# EasyEDA Pro project ProPrj_alba_2026-09-08.epro

# Schematic Schematic1
Board Name: Board1; Create Date: 2026-08-04; Page Name: P1; Project Name: alba; Schematic Name: Schematic1; Update Date: 2026-08-06; Company: 嘉立创EDA; Page Size: A4; Version: V1.0
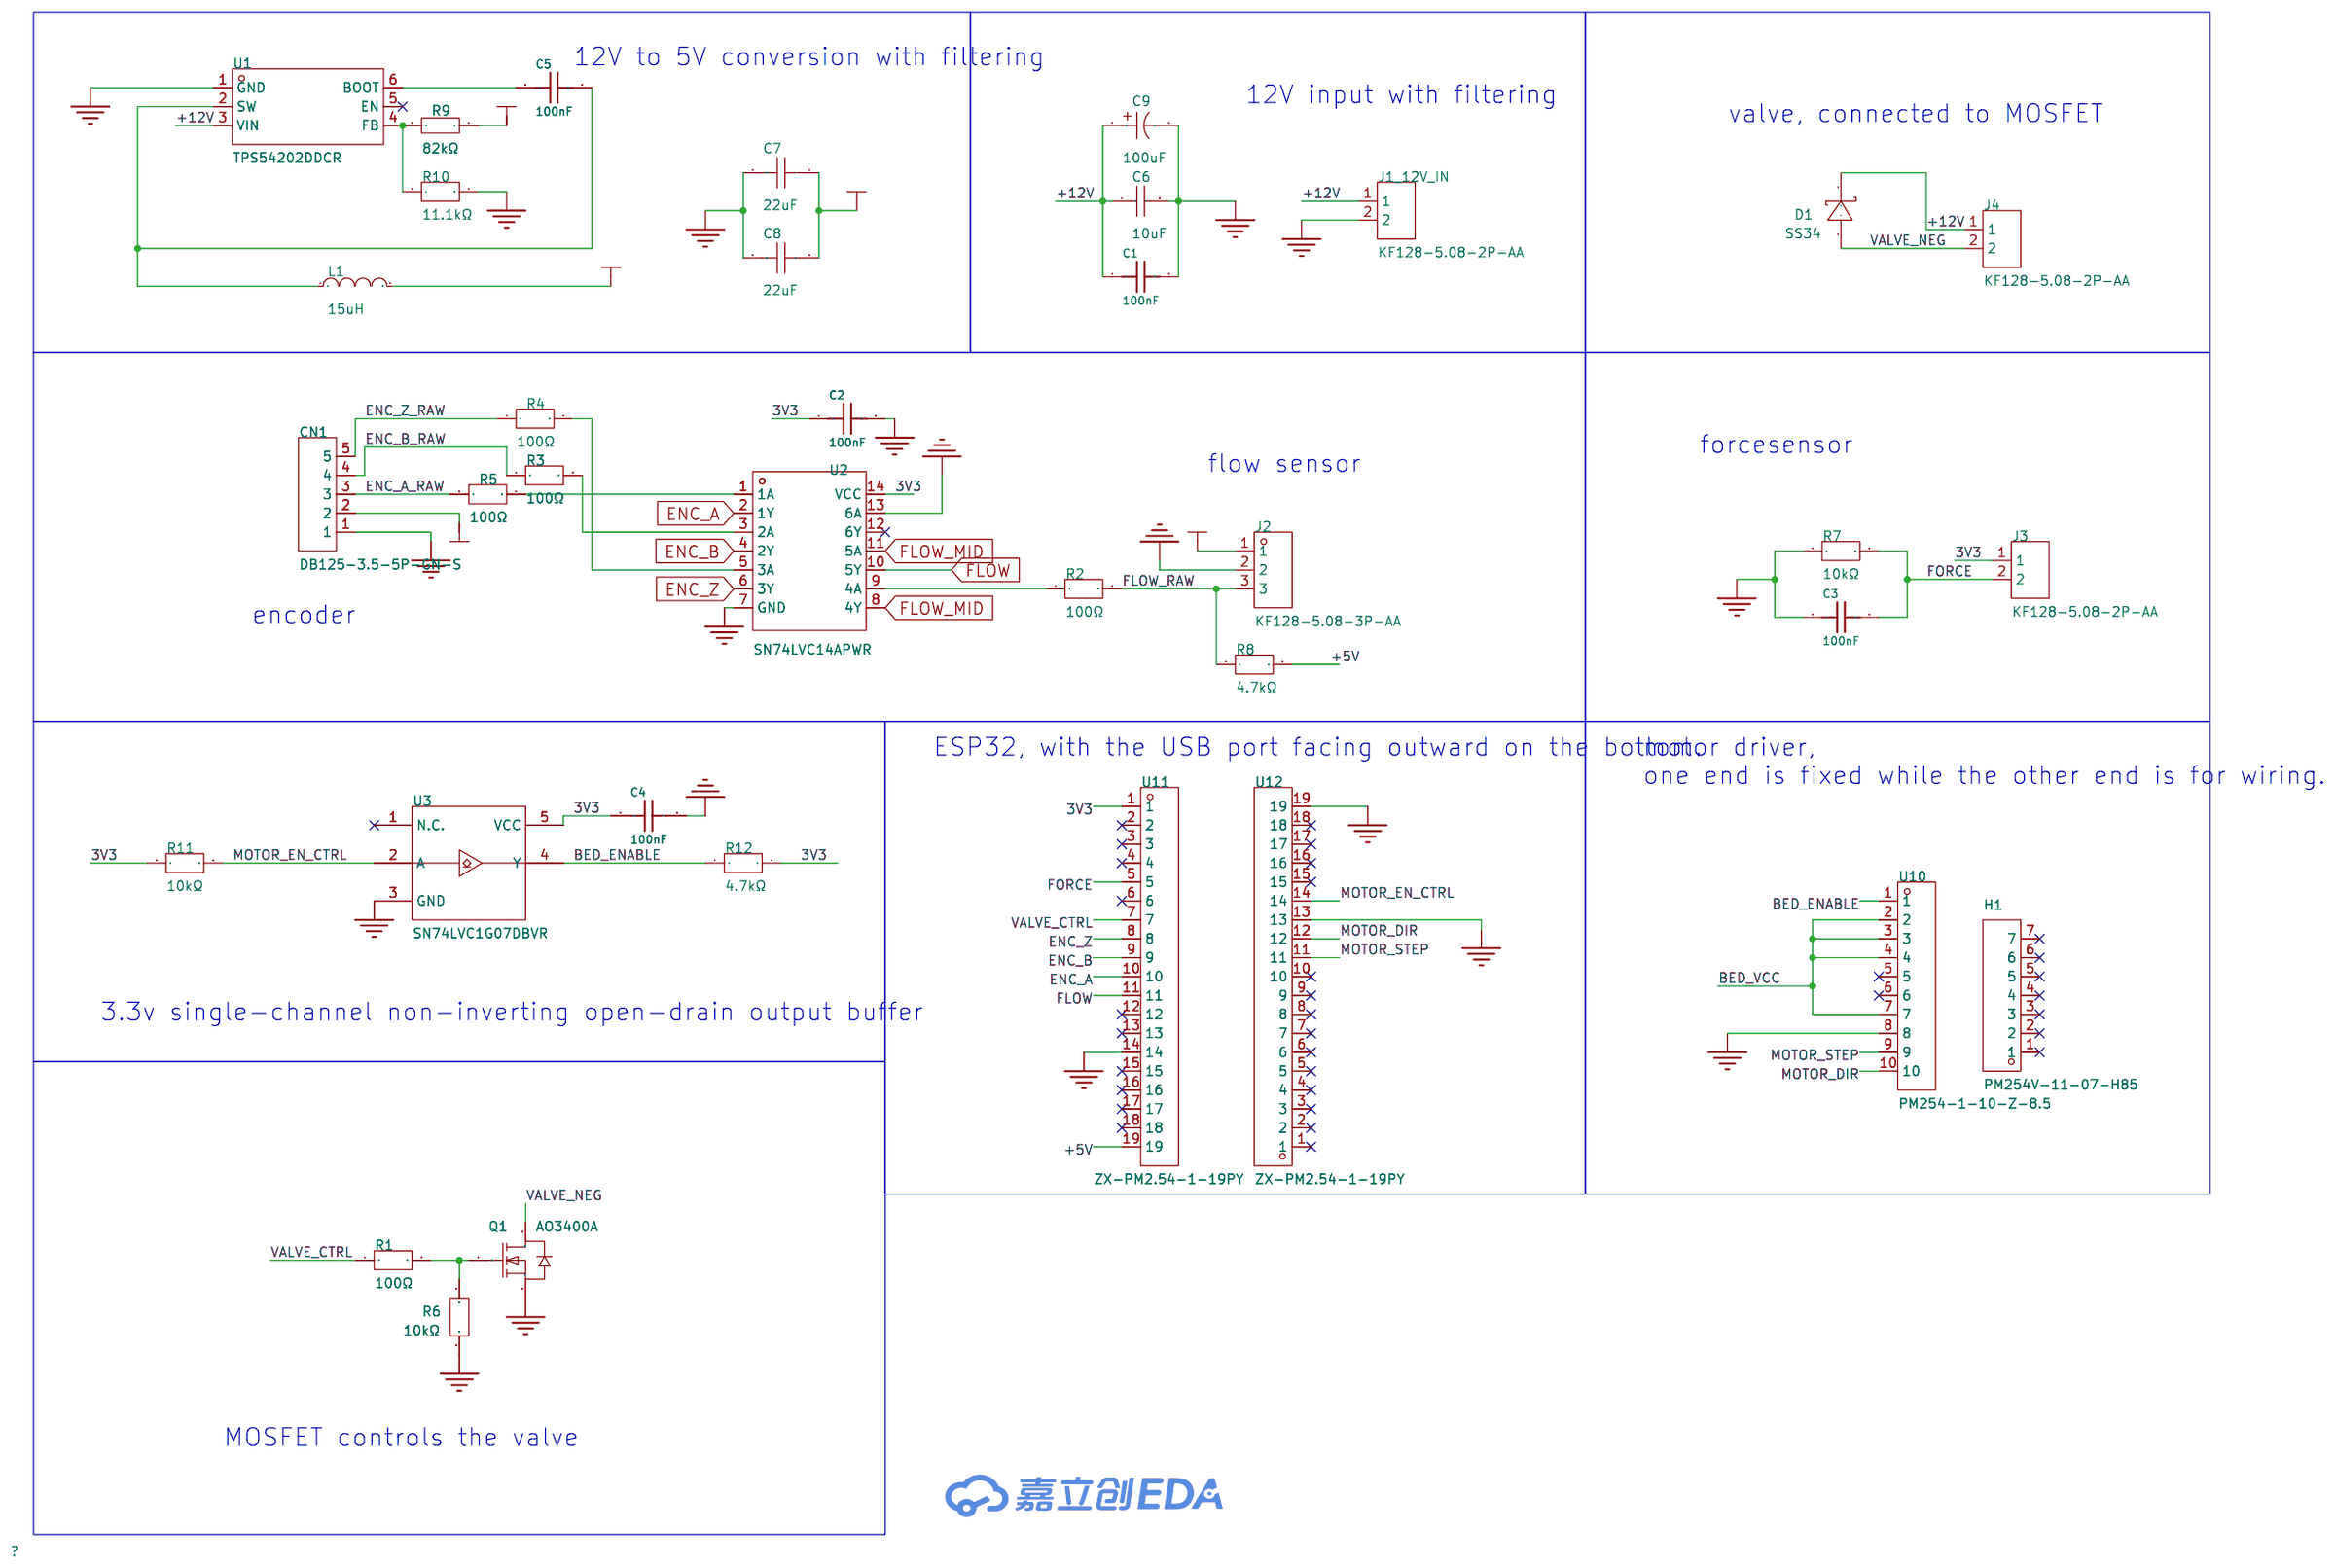
[diagram p0: schematic sheet]

## Parts
C1  100nF  [C0603]
C2  100nF  [C0603]
C3  100nF  [C0603]
C4  100nF  [C0603]
C5  100nF  [C0603]
C6  10uF  [C1206]
C7  22uF  [C1206]
C8  22uF  [C1206]
C9  100uF  [CAP-SMD_BD6.3-L6.6-W6.6-LS7.2-FD-1]
CN1  DB125-3.5-5P-GN-S  [CONN-TH_5P-P3.50_DORABO_DB125-3.5-5P-GN-S]
D1  SS34  [SMA_L4.3-W2.6-LS5.2-RD]
H1  PM254V-11-07-H85  [HDR-TH_7P-P2.54-V-F]
J1_12V_IN  KF128-5.08-2P-AA  [CONN-TH_P5.08_KF128-5.08-2P]
J2  KF128-5.08-3P-AA  [CONN-TH_3P-P5.08_KF128-5.08-3P]
J3  KF128-5.08-2P-AA  [CONN-TH_P5.08_KF128-5.08-2P]
J4  KF128-5.08-2P-AA  [CONN-TH_P5.08_KF128-5.08-2P]
L1  15uH  [IND-SMD_L7.2-W6.6_GPSR07X0]
Q1  AO3400A  [SOT-23-3_L2.9-W1.3-P1.90-LS2.4-BR]
R1  100Ω  [R0603]
R2  100Ω  [R0603]
R3  100Ω  [R0603]
R4  100Ω  [R0603]
R5  100Ω  [R0603]
R6  10kΩ  [R0603]
R7  10kΩ  [R0603]
R8  4.7kΩ  [R0603]
R9  82kΩ  [R0603]
R10  11.1kΩ  [R0603]
R11  10kΩ  [R0603]
R12  4.7kΩ  [R0603]
U1  TPS54202DDCR  [SOT-23-6_L2.9-W1.6-P0.95-LS2.8-BL]
U2  SN74LVC14APWR  [TSSOP-14_L5.0-W4.4-P0.65-LS6.4-BL]
U3  SN74LVC1G07DBVR  [SOT-23-5_L3.0-W1.7-P0.95-LS2.8-BR]
U10  PM254-1-10-Z-8.5  [HDR-TH_10P-P2.54-V-F]
U11  ZX-PM2.54-1-19PY  [HDR-TH_19P-P2.54-V-F]
U12  ZX-PM2.54-1-19PY  [HDR-TH_19P-P2.54-V-F]

## Library data of the parts
C1 = CC0603KRX7R9BB104: 容值:100nF;精度:±10%;额定电压:50V;温度系数:X7R;; LCSC Part Name: 100nF ±10% 50V; Supplier Part: C14663; Manufacturer: YAGEO(国巨); Supplier Footprint: 0603; JLCPCB Part Class: Basic Part; Datasheet: https://item.szlcsc.com/datasheet/CC0603KRX7R9BB104/15331.html; Supplier: LCSC; Tolerance: ±10%; Voltage Rating: 50V; Temperature Coefficient: X7R
C2-C5 = CC0603KRX7R9BB104: 容值:100nF;精度:±10%;额定电压:50V;温度系数:X7R;; LCSC Part Name: 100nF ±10% 50V; Supplier Part: C14663; Manufacturer: YAGEO(国巨); Supplier Footprint: 0603; JLCPCB Part Class: 基础库; Datasheet: https://item.szlcsc.com/datasheet/CC0603KRX7R9BB104/15331.html; Supplier: LCSC; Tolerance: ±10%; Voltage Rating: 50V; Temperature Coefficient: X7R
C6 = CL31A106KBHNNNE: 容值:10uF;精度:±10%;额定电压:50V;温度系数:X5R;; LCSC Part Name: 10uF ±10% 50V; Supplier Part: C13585; Manufacturer: SAMSUNG(三星); Supplier Footprint: 1206; JLCPCB Part Class: Basic Part; Datasheet: https://item.szlcsc.com/datasheet/CL31A106KBHNNNE/14236.html; Supplier: LCSC; Tolerance: ±10%; Voltage Rating: 50V; Temperature Coefficient: X5R
C7 C8 = 1206X226M100NT: 容值:22uF;精度:±20%;额定电压:10V;温度系数:X5R;; LCSC Part Name: 22uF ±20% 10V; Supplier Part: C108717; Manufacturer: FH(风华); Supplier Footprint: 1206; JLCPCB Part Class: 扩展库; Datasheet: https://item.szlcsc.com/datasheet/1206X226M100NT/109936.html; Supplier: LCSC; Tolerance: ±20%; Voltage Rating: 10V; Temperature Coefficient: X5R
C9 = RVT1E101M0607 100UF 25V: 容值:100uF;精度:±20%;额定电压:25V;纹波电流:93mA@120Hz;等效串联电阻(ESR):-;; LCSC Part Name: 100uF ±20% 25V; Supplier Part: C970685; Manufacturer: DMBJ(振宝佳); Supplier Footprint: SMD,D6.3xL7.7mm; JLCPCB Part Class: 扩展库; Datasheet: https://item.szlcsc.com/datasheet/RVT1E101M0607%2520100UF%252025V/1060413.html; Supplier: LCSC; Tolerance: ±20%; Voltage Rating: 25V; Ripple Current: 93mA@120Hz; Diameter: 6.3mm; Height - Seated (Max): 7.7mm; Lifetime: 2800hrs@105℃; Operating Temperature: -55℃~+105℃
CN1 = DB125-3.5-5P-GN-S: 结构:1x5P;间距:3.5mm;颜色:绿色;安装方式:直插;排数:1;每排PIN数:5;额定电流:10A;额定电压:300V;线规 - AWG:16~28;线规 - 平方毫米:1;工作温度:-40℃~+105℃;; LCSC Part Name: 1x5P 3.5mm 直插 排数:1 每排P数:5; Supplier Part: C3646874; Manufacturer: DORABO(地博电气); Supplier Footprint: 插件,P=3.5mm; JLCPCB Part Class: 扩展库; Datasheet: https://item.szlcsc.com/datasheet/DB125-3.5-5P-GN-S/4213692.html; Supplier: LCSC; Number of Positions or Pins: 1x5P; Pitch: 3.5mm; Color: 绿色; Mounting Type: 直插; Number of Pins: 5P; Number of Rows: 1; Number of PINs Per Row: 5; Screw Specification: M2; Current Rating: 10A; Voltage Rating (Max): 300V; Wire Gauge - AWG: 16~28; Wire Gauge - mm2: 1; Operating Temperature: -40℃~+105℃
D1 = SS34_C8678: 二极管配置:独立式;正向压降(Vf):550mV@3A;直流反向耐压(Vr):40V;整流电流:3A;; LCSC Part Name: 电压:40V 电流:3A; Supplier Part: C8678; Manufacturer: MDD(辰达半导体); Supplier Footprint: SMA(DO-214AC); JLCPCB Part Class: 基础库; Datasheet: https://item.szlcsc.com/datasheet/SS34/9178.html; Supplier: LCSC; Diode Configuration: 独立式; Voltage - Forward(Vf@If): 550mV@3A; Voltage - DC Reverse(Vr): 40V; Current - Rectified: 3A; Reverse Leakage Current (Ir): 500uA@40V; Operating Junction Temperature Range: -55℃~+125℃
H1 = PM254V-11-07-H85: 插孔结构:1x7P;间距:2.54mm;行距:-;圆孔/方孔:方孔;安装方式:直插;排数:单排;总孔位数:7P;额定电流:3A;额定电压:250V;插孔方向:顶部;塑高:-;工作温度:-40℃~+105℃;; LCSC Part Name: 间距:2.54mm 1x7P 直插; Supplier Part: C2832270; Manufacturer: XFCN(兴飞); Supplier Footprint: 插件,P=2.54mm; JLCPCB Part Class: 扩展库; Datasheet: https://item.szlcsc.com/datasheet/PM254V-11-07-H85/2989788.html; Supplier: LCSC; Holes Structure: 1x7P; Pitch: 2.54mm; Circular Hole / Square Hole: 方孔; Mounting Type: 直插; Number of Rows: 单排; Number of Positions: 7P; Current Rating: 3A; Voltage Rating (Max): 250V; Holes Direction: 顶部; Operating Temperature: -40℃~+105℃
J1_12V_IN J3 J4 = KF128-5.08-2P-AA: 结构:1x2P;间距:5.08mm;颜色:绿色;安装方式:直插;排数:1;每排PIN数:2;额定电流:24A;额定电压:250V;线规 - AWG:12~22;线规 - 平方毫米:2.5;工作温度:-40℃~+105℃;; LCSC Part Name: 5.08mm 1x2P 排数:1 每排P数:2 直插; Supplier Part: C474952; Manufacturer: KEFA(科发); Supplier Footprint: 插件,P=5.08mm; JLCPCB Part Class: 扩展库; Datasheet: https://item.szlcsc.com/datasheet/KF128-5.08-2P-AA/481570.html; Supplier: LCSC; Number of Positions or Pins: 1x2P; Pitch: 5.08mm; Color: 绿色; Mounting Type: 直插; Number of Pins: 2P; Number of Rows: 1; Number of PINs Per Row: 2; Current Rating: 24A; Voltage Rating (Max): 250V; Wire Gauge - AWG: 12~22; Wire Gauge - mm2: 2.5; Operating Temperature: -40℃~+105℃
J2 = KF128-5.08-3P-AA: 结构:1x3P;间距:5.08mm;颜色:绿色;安装方式:直插;排数:1;每排PIN数:3;额定电流:24A;额定电压:250V;线规 - AWG:12~22;线规 - 平方毫米:2.5;工作温度:-40℃~+105℃;; LCSC Part Name: 1x3P 5.08mm 直插 排数:1 每排P数:3; Supplier Part: C474953; Manufacturer: KEFA(科发); Supplier Footprint: 插件,P=5.08mm; JLCPCB Part Class: Extended Part; Datasheet: https://item.szlcsc.com/datasheet/KF128-5.08-3P-AA/481571.html; Supplier: LCSC; Number of Positions or Pins: 1x3P; Pitch: 5.08mm; Color: 绿色; Mounting Type: 直插; Number of Pins: 3P; Number of Rows: 1; Number of PINs Per Row: 3; Current Rating: 24A; Voltage Rating (Max): 250V; Wire Gauge - AWG: 12~22; Wire Gauge - mm2: 2.5; Operating Temperature: -40℃~+105℃
L1 = CYA0630-15UH: 电感值:15uH;精度:±20%;额定电流:3A;直流电阻(DCR):98mΩ;; LCSC Part Name: 15uH ±20%; Supplier Part: C5189959; Manufacturer: SHOU HAN(首韩); Supplier Footprint: SMD,7.2x6.6mm; JLCPCB Part Class: 扩展库; Datasheet: https://atta.szlcsc.com/upload/public/pdf/source/20230523/5F86F4489D0E29735640AB8FD07036BA.pdf; Supplier: LCSC; Tolerance: ±20%; Rated Current: 3A; DC Resistance (DCR): 98mΩ
Q1 = AO3400A_C20917: 数量:-;漏源电压(Vdss):30V;连续漏极电流(Id):-;导通电阻(RDS(on)):48mΩ@2.5V;耗散功率(Pd):-;阈值电压(Vgs(th)):1.45V@250uA;; LCSC Part Name: 1个N沟道 耐压:30V 电流:5.7A; Supplier Part: C20917; Manufacturer: AOS; Supplier Footprint: SOT-23-3L; JLCPCB Part Class: 基础库; Datasheet: https://item.szlcsc.com/datasheet/AO3400A/21629.html; Supplier: LCSC; Drain to Source Voltage: 30V; RDS(on): 48mΩ@2.5V; Gate Threshold Voltage (Vgs(th)): 1.45V@250uA; Gate Charge(Qg): 7nC@10V; Input Capacitance(Ciss): 630pF@15V; Operating Temperature: -55℃~+150℃@(Tj); Type: N沟道
R1-R5 = FRC0603F1000TS: 电阻类型:厚膜电阻;阻值:100Ω;精度:±1%;功率:100mW;工作电压:75V;温度系数:±100ppm/℃;; LCSC Part Name: 100Ω ±1% 100mW 厚膜电阻; Supplier Part: C2906981; Manufacturer: FOJAN(富捷); Supplier Footprint: 0603; JLCPCB Part Class: 扩展库; Datasheet: https://item.szlcsc.com/datasheet/FRC0603F1000TS/3180494.html; Supplier: LCSC; Type: 厚膜电阻; Tolerance: ±1%; Power(Watts): 100mW; Voltage-Supply(Max): 75V; Temperature Coefficient: ±100ppm/℃; Operating Temperature: -55℃~+155℃
R6 R7 R11 = FRC0603F1002TS: 电阻类型:厚膜电阻;阻值:10kΩ;精度:±1%;功率:100mW;工作电压:75V;温度系数:±100ppm/℃;; LCSC Part Name: 10kΩ ±1% 100mW 厚膜电阻; Supplier Part: C2906982; Manufacturer: FOJAN(富捷); Supplier Footprint: 0603; JLCPCB Part Class: 扩展库; Datasheet: https://item.szlcsc.com/datasheet/FRC0603F1002TS/3180495.html; Supplier: LCSC; Type: 厚膜电阻; Tolerance: ±1%; Power(Watts): 100mW; Voltage-Supply(Max): 75V; Temperature Coefficient: ±100ppm/℃; Operating Temperature: -55℃~+155℃
R8 R12 = FRC0603F4701TS: 电阻类型:厚膜电阻;阻值:4.7kΩ;精度:±1%;功率:100mW;工作电压:75V;温度系数:±100ppm/℃;; LCSC Part Name: 4.7kΩ ±1% 100mW 厚膜电阻; Supplier Part: C2907034; Manufacturer: FOJAN(富捷); Supplier Footprint: 0603; JLCPCB Part Class: 扩展库; Datasheet: https://item.szlcsc.com/datasheet/FRC0603F4701TS/3180547.html; Supplier: LCSC; Type: 厚膜电阻; Tolerance: ±1%; Power(Watts): 100mW; Voltage-Supply(Max): 75V; Temperature Coefficient: ±100ppm/℃; Operating Temperature: -55℃~+155℃
R9 = 0603WAF8202T5E: 电阻类型:厚膜电阻;阻值:82kΩ;精度:±1%;功率:100mW;工作电压:75V;温度系数:±100ppm/℃;; LCSC Part Name: 82kΩ ±1% 100mW 厚膜电阻; Supplier Part: C23254; Manufacturer: UNI-ROYAL(厚声); Supplier Footprint: 0603; JLCPCB Part Class: 基础库; Datasheet: https://item.szlcsc.com/datasheet/0603WAF8202T5E/23981.html; Supplier: LCSC; Type: 厚膜电阻; Tolerance: ±1%; Power(Watts): 100mW; Voltage-Supply(Max): 75V; Temperature Coefficient: ±100ppm/℃; Operating Temperature: -55℃~+155℃
R10 = TNPW060311K1BEEA: 电阻类型:薄膜电阻;阻值:11.1kΩ;精度:±0.1%;功率:125mW;工作电压:75V;温度系数:±25ppm/℃;; LCSC Part Name: 薄膜电阻 11.1kΩ ±0.1% 125mW; Supplier Part: C1854558; Manufacturer: VISHAY(威世); Supplier Footprint: 0603; JLCPCB Part Class: 扩展库; Datasheet: https://item.szlcsc.com/datasheet/TNPW060311K1BEEA/1945371.html; Supplier: LCSC; Type: 薄膜电阻; Tolerance: ±0.1%; Power(Watts): 125mW; Voltage-Supply(Max): 75V; Temperature Coefficient: ±25ppm/℃; Operating Temperature: -55℃~+155℃
U1 = TPS54202DDCR: 功能类型:降压型;工作电压:4.5V~28V;输出电压:-;输出电流:2A;输出类型:可调;; LCSC Part Name: 降压型 2A 4.5V~28V; Supplier Part: C191884; Manufacturer: TI(德州仪器); Supplier Footprint: SOT-23-6; JLCPCB Part Class: 扩展库; Datasheet: https://www.ti.com/cn/lit/gpn/tps54202; Supplier: LCSC; Function: 降压型; Voltage - Supply: 4.5V~28V; Output Current: 2A; Frequency - Switching: 500kHz; Operating Temperature: -40℃~+125℃@(TJ); Synchronous Rectifier: 是; Number of Outputs: 1; Topology: 降压式; Quiescent Current: 45uA; Switch tube (built-in/external): 内置; Output Type: 可调; Features: 轻载高效模式；逐波限流；过流保护；EMI优化(抖频模式)；打嗝限流
U2 = SN74LVC14APWR: 输入类型:施密特触发器;工作电压:1.65V~3.6V;静态电流(Iq):1uA;通道数:6;传播延迟(tpd):6.2ns@3.3V,50pF;; LCSC Part Name: 六路施密特触发反相器; Supplier Part: C7663; Manufacturer: TI(德州仪器); Supplier Footprint: TSSOP-14; JLCPCB Part Class: 扩展库; Datasheet: https://www.ti.com/cn/lit/gpn/sn74lvc14a; Supplier: LCSC; Input Type: 施密特触发器; Voltage - Supply: 1.65V~3.6V; Quiescent Current(Iq): 1uA; Number of Circuits: 6; Number of Inputs: 1; Current - Output Low(IOL): 24mA; Current - Output High(IOH): 24mA; Input Logic Level - High: 1.3V~2V; Input Logic Level -Low: 150mV~800mV; Output Logic Level - High: 2.4V; Output Logic Level - Low: 550mV; Propagation Delay: 6.2ns@3.3V,50pF; Series: 74LVC系列; Operating Temperature: -40℃~+125℃
U3 = SN74LVC1G07DBVR: 输入类型:-;工作电压:1.65V~5.5V;元件数:1;每个元件位数:1;灌电流(IOL):32mA;拉电流(IOH):-;; LCSC Part Name: 单路缓冲器/驱动器，漏极开路输出; Supplier Part: C7829; Manufacturer: TI(德州仪器); Supplier Footprint: SOT-23-5; JLCPCB Part Class: 扩展库; Datasheet: https://www.ti.com/cn/lit/gpn/sn74lvc1g07; Supplier: LCSC; output type: 开漏; Voltage - Supply: 1.65V~5.5V; Number of Elements: 1; Number of Bits per Element: 1; Channel Type: 单向; Current - Output Low(IOL): 32mA; Logic Family: 74LVC; Operating Temperature: -40℃~+125℃; Quiescent Current: 10uA; Propagation Delay: 4.2ns@3.3V,50pF
U10 = PM254-1-10-Z-8.5: 插孔结构:1x10P;间距:2.54mm;行距:-;圆孔/方孔:方孔;安装方式:直插;排数:单排;总孔位数:10P;额定电流:3A;额定电压:-;插孔方向:顶部;塑高:8.5mm;触头材质:铜合金;工作温度:-40℃~+105℃;; LCSC Part Name: 1x10P 间距:2.54mm 直插; Supplier Part: C2897373; Manufacturer: HCTL(华灿天禄); Supplier Footprint: 插件,P=2.54mm; JLCPCB Part Class: 扩展库; Datasheet: https://item.szlcsc.com/datasheet/PM254-1-10-Z-8.5/3142378.html; Supplier: LCSC; Holes Structure: 1x10P; Pitch: 2.54mm; Circular Hole / Square Hole: 方孔; Mounting Type: 直插; Number of Rows: 单排; Number of Positions: 10P; Current Rating: 3A; Holes Direction: 顶部; Insulation Height: 8.5mm; Contact Material: 铜合金; Operating Temperature: -40℃~+105℃
U11 U12 = ZX-PM2.54-1-19PY: 插孔结构:1x19P;间距:2.54mm;行距:-;圆孔/方孔:方孔;安装方式:直插;排数:单排;总孔位数:19P;额定电流:3A;额定电压:-;插孔方向:顶部;塑高:8.5mm;触头材质:黄铜;触头镀层:金;工作温度:-40℃~+105℃;; LCSC Part Name: 1x19P 间距:2.54mm 直插; Supplier Part: C7499335; Manufacturer: Megastar(兆星); Supplier Footprint: 插件,P=2.54mm; JLCPCB Part Class: 扩展库; Datasheet: https://item.szlcsc.com/datasheet/ZX-PM2.54-1-19PY/8573996.html; Supplier: LCSC; Holes Structure: 1x19P; Pitch: 2.54mm; Circular Hole / Square Hole: 方孔; Mounting Type: 直插; Number of Rows: 单排; Number of Positions: 19P; Current Rating: 3A; Holes Direction: 顶部; Insulation Height: 8.5mm; Contact Material: 黄铜; Contact Plating: 金; Operating Temperature: -40℃~+105℃; PIN Length: 3.2mm

## Nets
3V3: C2.1 C4.1 J3.1 R11.1 R12.2 U2.14(VCC) U3.5(VCC) U11.1
+5V: C7.1 C8.1 CN1.2 J2.1 L1.2 R8.2 R9.2 U11.19
+12V: C1.1 C6.1 C9.1 D1.1(K) J1_12V_IN.1 J4.1 U1.3(VIN)
GND: C1.2 C2.2 C3.1 C4.2 C6.2 C7.2 C8.2 C9.2 CN1.1 J1_12V_IN.2 J2.2 Q1.2(S) R6.1 R7.1 R10.2 U1.1(GND) U2.7(GND) U2.13(6A) U3.3(GND) U10.8 U11.14 U12.13 U12.19
BED_ENABLE: R12.1 U3.4(Y) U10.1
BED_VCC: U10.2 U10.3 U10.4 U10.7
ENC_A: U2.2(1Y) U11.10
ENC_A_RAW: CN1.3 R5.1
ENC_B: U2.4(2Y) U11.9
ENC_B_RAW: CN1.4 R3.1
ENC_Z: U2.6(3Y) U11.8
ENC_Z_RAW: CN1.5 R4.1
FLOW: U2.10(5Y) U11.11
FLOW_MID: U2.8(4Y) U2.11(5A)
FLOW_RAW: J2.3 R2.2 R8.1
FORCE: C3.2 J3.2 R7.2 U11.5
MOTOR_DIR: U10.10 U12.12
MOTOR_EN_CTRL: R11.2 U3.2(A) U12.14
MOTOR_STEP: U10.9 U12.11
VALVE_CTRL: R1.1 U11.7
VALVE_NEG: D1.2(A) J4.2 Q1.3(D)
$1N2491: C5.1 U1.6(BOOT)
$1N2497: C5.2 L1.1 U1.2(SW)
$1N2551: R9.1 R10.1 U1.4(FB)
$1N3307: R5.2 U2.1(1A)
$1N3560: R3.2 U2.3(2A)
$1N3669: R2.1 U2.9(4A)
$1N3677: R4.2 U2.5(3A)
$1N3934: Q1.1(G) R1.2 R6.2

Not connected (* = marked no-connect by the designer): H1 1* 2* 3* 4* 5* 6* 7*; U1 5(EN)*; U2 12(6Y)*; U3 1(N.C.)*; U10 5* 6*; U11 2* 3* 4* 6* 12* 13* 15* 16* 17* 18*; U12 1* 2* 3* 4* 5* 6* 7* 8* 9* 10* 15* 16* 17* 18*

## Notes on the sheet
- 12V to 5V conversion with filtering
- 12V input with filtering
- valve, connected to MOSFET
- forcesensor
- flow sensor
- encoder
- ESP32, with the USB port facing outward on the bottom.
- motor driver,
  one end is fixed while the other end is for wiring.
- 3.3v single-channel non-inverting open-drain output buffer
- MOSFET controls the valve

# Board PCB1
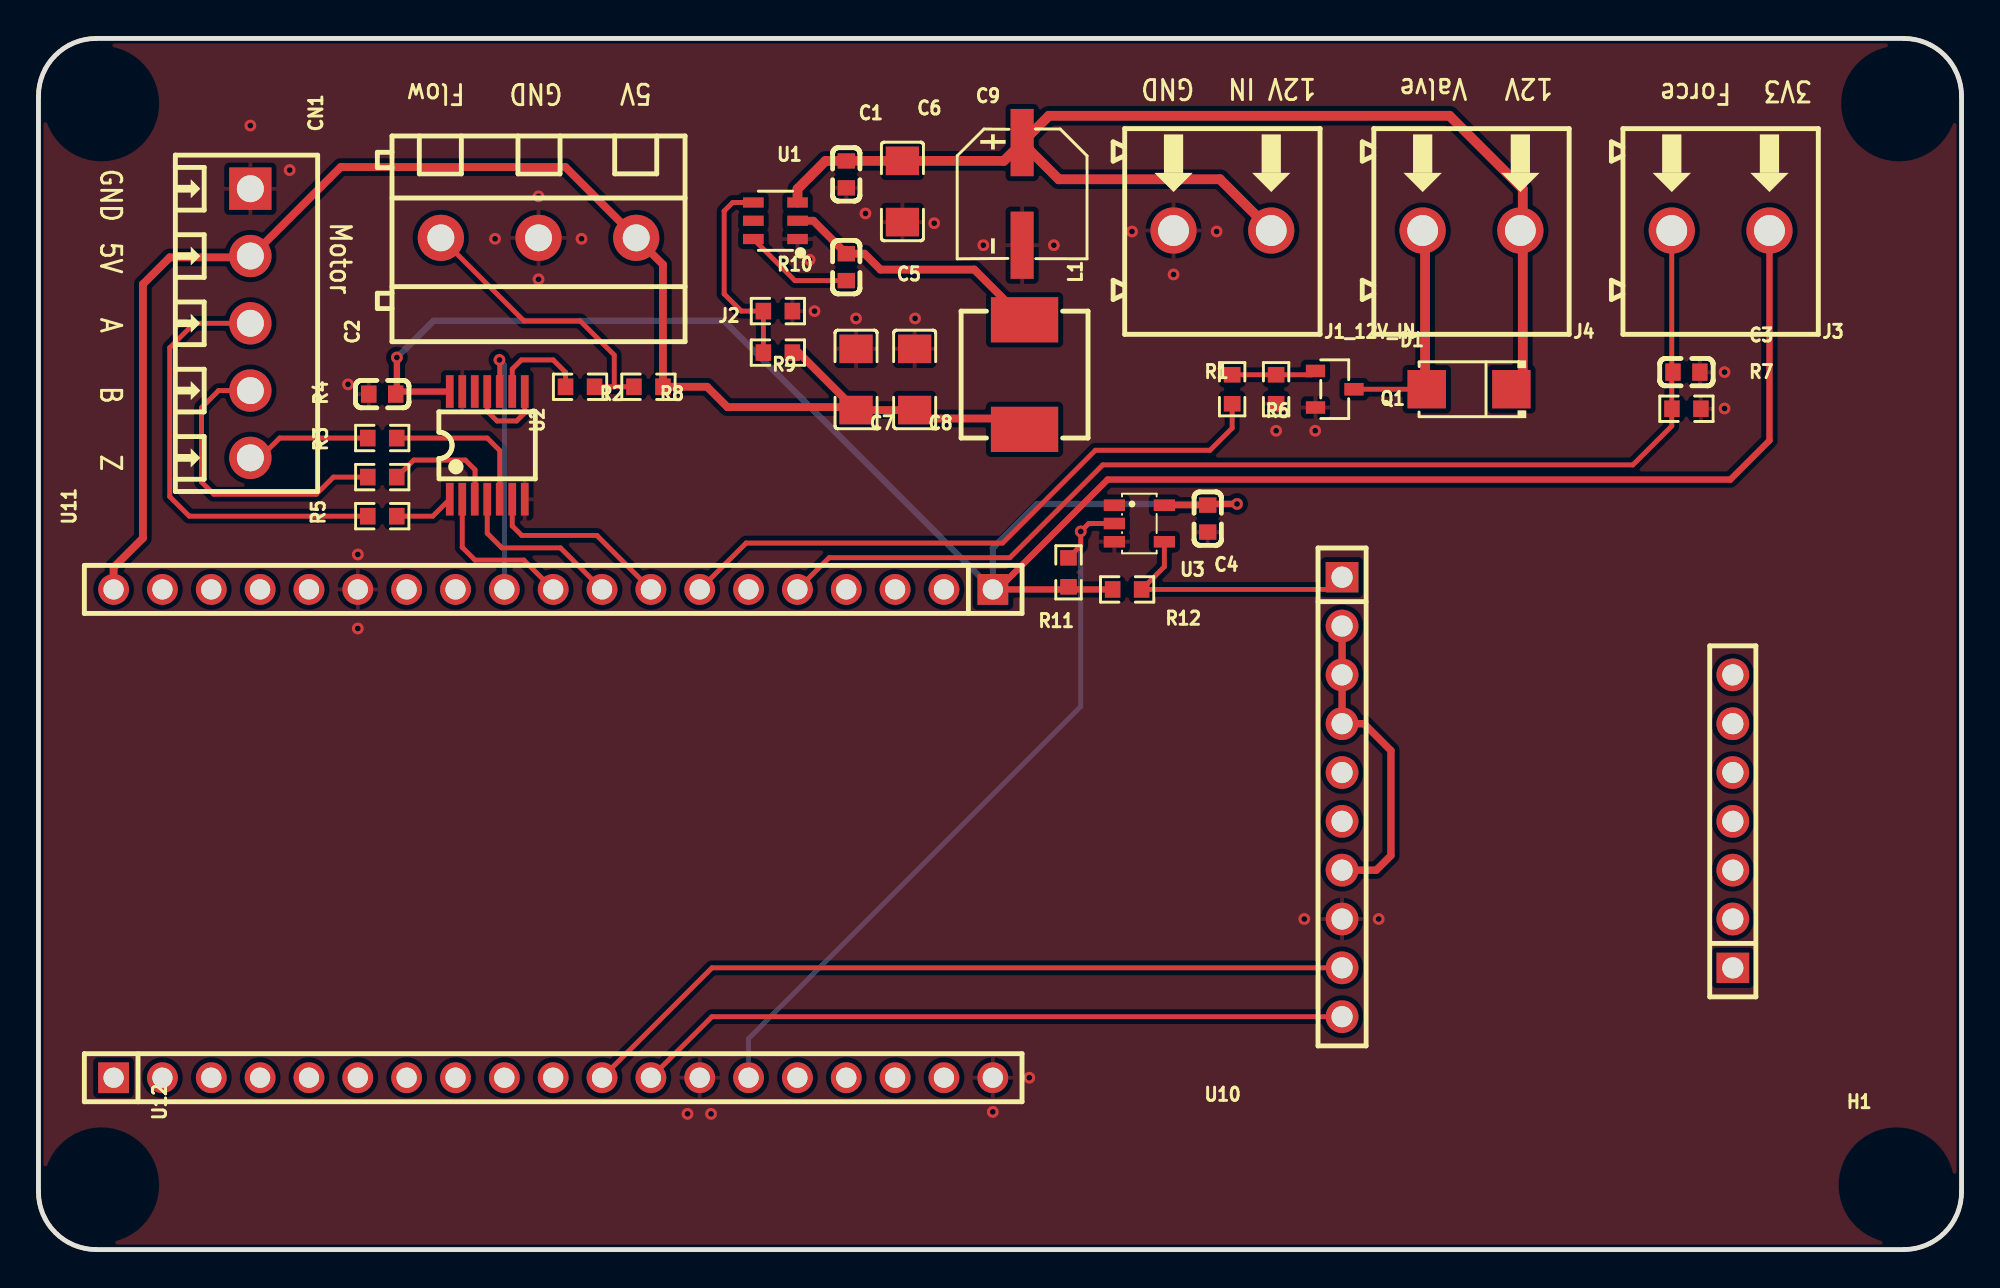
[diagram p1: board, top side]
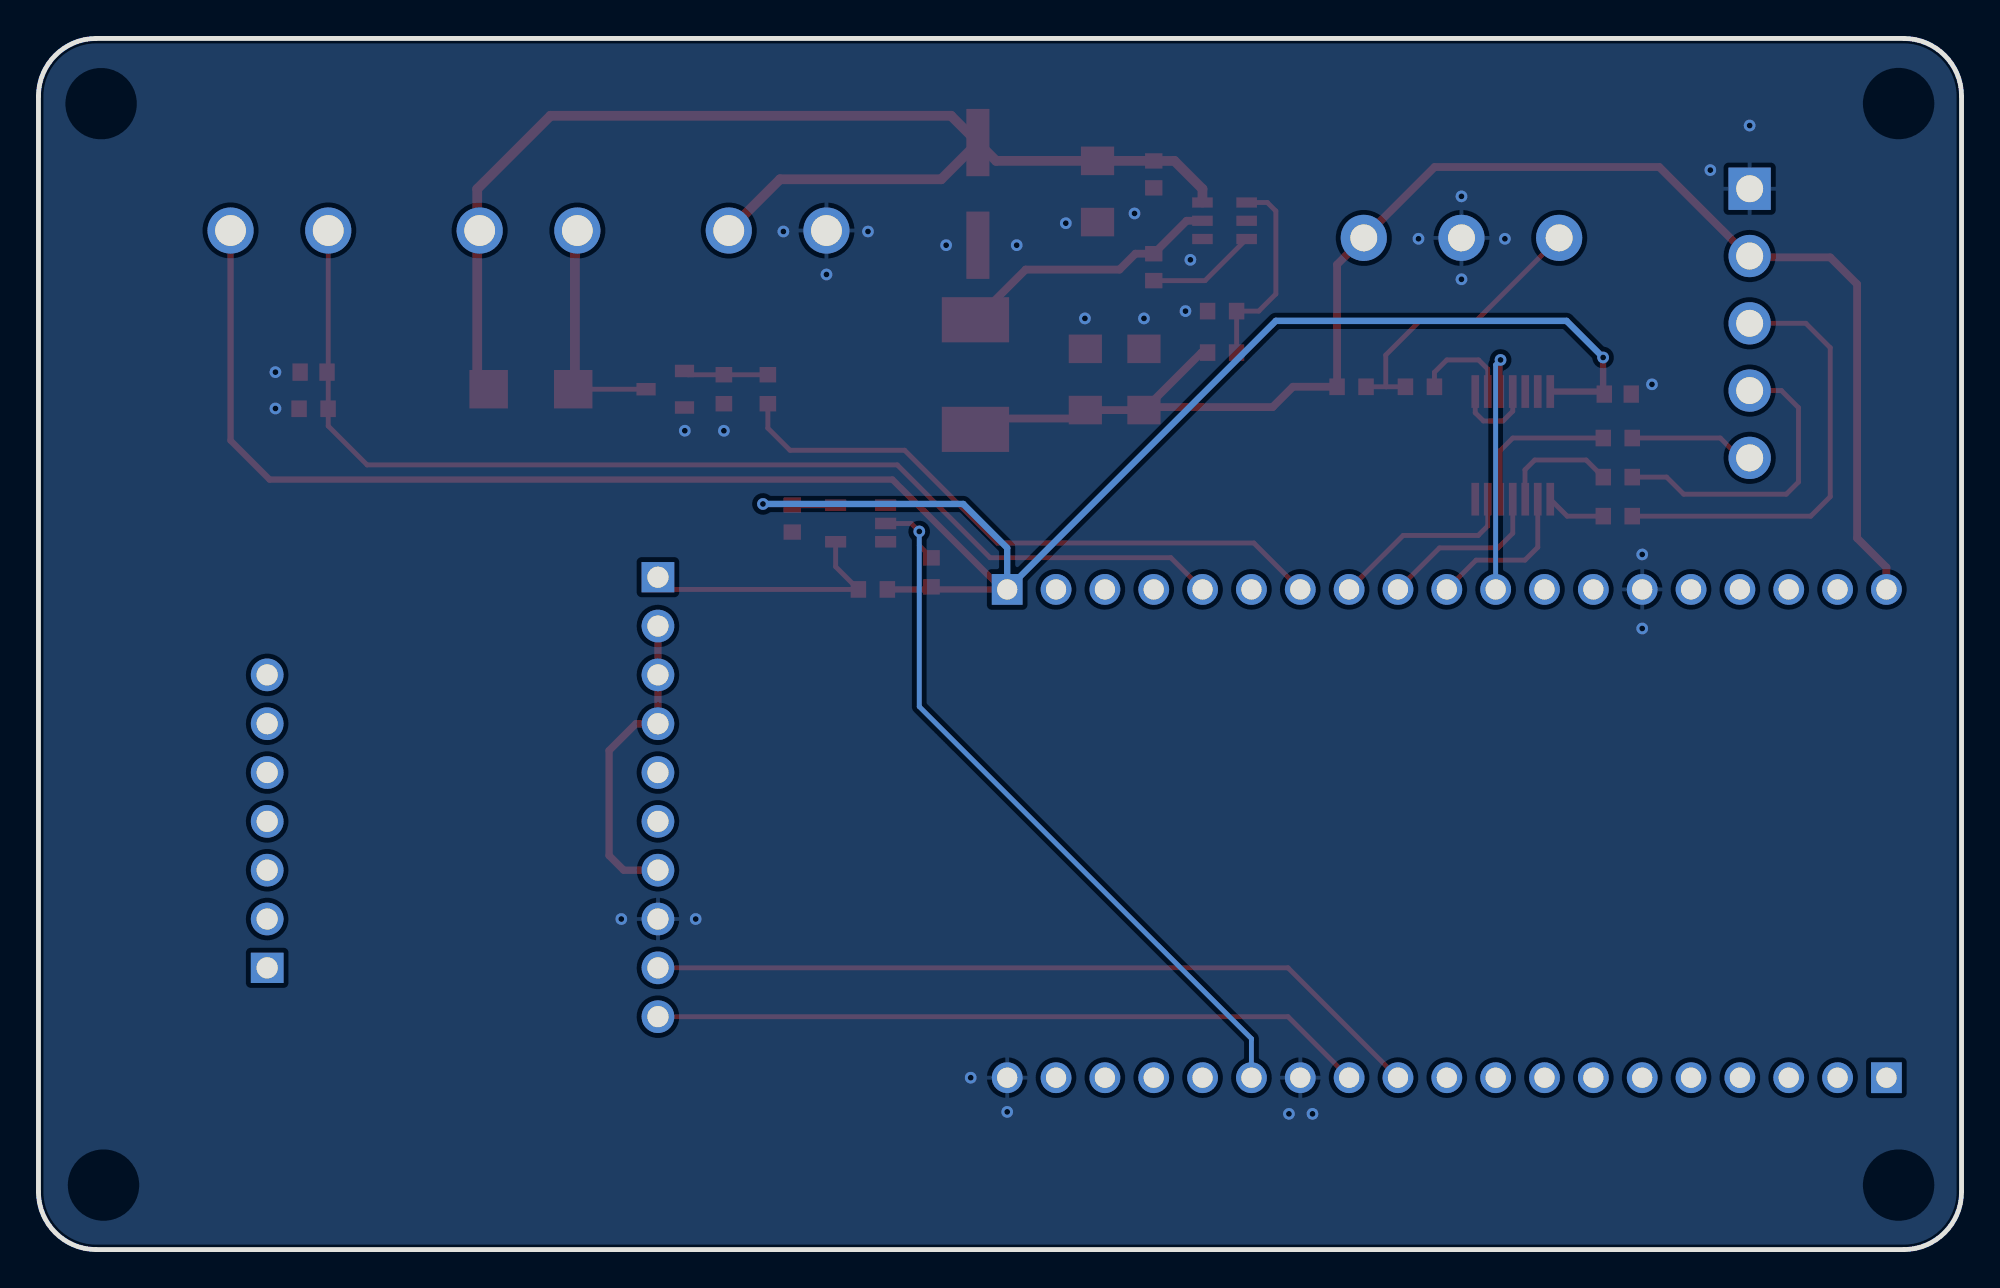
[diagram p2: board, bottom side, seen from below]

Outline 100 x 63 mm; copper layers: Top Layer, Bottom Layer. Coordinates in mm from the lower left corner of the outline.
Outline path: 0,60 0,3 arc(0.88,0.88) 3,0 97,0 arc(99.12,0.88) 100,3 100,60 arc(99.12,62.12) 97,63 3,63 arc(0.88,62.12) 0,60
Stack: Top Layer 0.035mm / Dielectric1 1.51mm FR4 er 4.5 / Bottom Layer 0.035mm

## Design rules (mm)
template: JLCPCB Capability(Two Layers Board)
spacing copperThickness1oz (default): track to track 0.102, other pairs 0.152 to 0.3
spacing copperThickness2oz: track to track 0.203, other pairs 0.152 to 0.3
track width copperThickness1oz (default): min 0.127, default 0.254, max 2.54
track width copperThickness2oz: min 0.203, default 0.254, max 2.54
differential pair differentialPair (default): width min 0.127, default 0.254, max 2.54; gap min 0.152, default 0.152
via viaSize (default): diameter min 0.5, default 0.61, max 10; hole min 0.3, default 0.305, max 6.3

## Placement (name value [footprint] x y rotation side)
C1  100nF  [C0603]  42.01 55.93 270 top
C2  100nF  [C0603]  17.88 44.5 180 top
C3  100nF  [C0603]  85.69 45.64 180 top
C4  100nF  [C0603]  60.8 38.02 270 top
C5  100nF  [C0603]  42.01 51.1 90 top
C6  10uF  [C1206]  44.93 55.04 270 top
C7  22uF  [C1206]  42.51 45.26 90 top
C8  22uF  [C1206]  45.56 45.26 90 top
C9  100uF  [CAP-SMD_BD6.3-L6.6-W6.6-LS7.2-FD-1]  51.15 54.91 270 top
CN1  DB125-3.5-5P-GN-S  [CONN-TH_5P-P3.50_DORABO_DB125-3.5-5P-GN-S]  11.02 48.18 270 top
D1  SS34  [SMA_L4.3-W2.6-LS5.2-RD]  74.39 44.75 180 top
H1  PM254V-11-07-H85  [HDR-TH_7P-P2.54-V-F]  88.11 22.27 90 top
J1_12V_IN  KF128-5.08-2P-AA  [CONN-TH_P5.08_KF128-5.08-2P]  61.56 53.01 180 top
J2  KF128-5.08-3P-AA  [CONN-TH_3P-P5.08_KF128-5.08-3P]  26 52.63 180 top
J3  KF128-5.08-2P-AA  [CONN-TH_P5.08_KF128-5.08-2P]  87.47 53.01 180 top
J4  KF128-5.08-2P-AA  [CONN-TH_P5.08_KF128-5.08-2P]  74.52 53.01 180 top
L1  15uH  [IND-SMD_L7.2-W6.6_GPSR07X0]  51.28 45.52 270 top
Q1  AO3400A  [SOT-23-3_L2.9-W1.3-P1.90-LS2.4-BR]  67.41 44.75 180 top
R1  100Ω  [R0603]  62.07 44.75 90 top
R2  100Ω  [R0603]  28.16 44.88 0 top
R3  100Ω  [R0603]  17.88 40.18 0 top
R4  100Ω  [R0603]  17.88 42.21 0 top
R5  100Ω  [R0603]  17.88 38.15 0 top
R6  10kΩ  [R0603]  64.36 44.75 90 top
R7  10kΩ  [R0603]  85.69 43.74 180 top
R8  4.7kΩ  [R0603]  31.72 44.88 0 top
R9  82kΩ  [R0603]  38.45 46.66 0 top
R10  11.1kΩ  [R0603]  38.45 48.82 0 top
R11  10kΩ  [R0603]  53.56 35.23 90 top
R12  4.7kΩ  [R0603]  56.61 34.34 180 top
U1  TPS54202DDCR  [SOT-23-6_L2.9-W1.6-P0.95-LS2.8-BL]  38.32 53.52 90 top
U2  SN74LVC14APWR  [TSSOP-14_L5.0-W4.4-P0.65-LS6.4-BL]  23.34 41.83 0 top
U3  SN74LVC1G07DBVR  [SOT-23-5_L3.0-W1.7-P0.95-LS2.8-BR]  57.25 37.77 180 top
U10  PM254-1-10-Z-8.5  [HDR-TH_10P-P2.54-V-F]  67.79 23.54 270 top
U11  ZX-PM2.54-1-19PY  [HDR-TH_19P-P2.54-V-F]  26.77 34.34 180 top
U12  ZX-PM2.54-1-19PY  [HDR-TH_19P-P2.54-V-F]  26.77 8.94 0 top

## Footprints (pads in the part's own frame, mm; a bottom-side part is the same pattern mirrored in y, then rotated)
C0603
  rect 0.8x0.9 smd: 1(-0.7,0) 2(0.7,0)
C1206
  rect 1.485x1.728 smd: 1(-1.593,0) 2(1.593,0)
CAP-SMD_BD6.3-L6.6-W6.6-LS7.2-FD-1
  rect 3.5x1.2 smd: 1(-2.67,0) 2(2.67,0)
CONN-TH_3P-P5.08_KF128-5.08-3P
  round 2.4 hole 1.4: 1(-5.08,0) 2(0,0) 3(5.08,0)
CONN-TH_5P-P3.50_DORABO_DB125-3.5-5P-GN-S
  rect 2.2x2.2 hole 1.4: 1(-7,0)
  round 2.2 hole 1.4: 2(-3.5,0) 3(0,0) 4(3.5,0) 5(7,0)
CONN-TH_P5.08_KF128-5.08-2P
  round 2.4 hole 1.6: 1(-2.54,0) 2(2.54,0)
HDR-TH_7P-P2.54-V-F
  rect 1.575x1.7 hole 1.1: 1(-7.62,0)
  round 1.7 hole 1.1: 2(-5.08,0) 3(-2.54,0) 4(0,0) 5(2.54,0) 6(5.08,0) 7(7.62,0)
HDR-TH_10P-P2.54-V-F
  rect 1.575x1.7 hole 1.1: 1(-11.43,0)
  round 1.7 hole 1.1: 2(-8.89,0) 3(-6.35,0) 4(-3.81,0) 5(-1.27,0) 6(1.27,0) 7(3.81,0) 8(6.35,0) 9(8.89,0) 10(11.43,0)
HDR-TH_19P-P2.54-V-F
  rect 1.6x1.6 hole 1.05: 1(-22.86,0)
  round 1.6 hole 1.05: 2(-20.32,0) 3(-17.78,0) 4(-15.24,0) 5(-12.7,0) 6(-10.16,0) 7(-7.62,0) 8(-5.08,0) 9(-2.54,0) 10(0,0) 11(2.54,0) 12(5.08,0) 13(7.62,0) 14(10.16,0) 15(12.7,0) 16(15.24,0) 17(17.78,0) 18(20.32,0) 19(22.86,0)
IND-SMD_L7.2-W6.6_GPSR07X0
  rect 2.35x3.5 smd: 1(-2.85,0) 2(2.85,0)
R0603
  rect 0.806x0.864 smd: 1(-0.753,0) 2(0.753,0)
SMA_L4.3-W2.6-LS5.2-RD
  rect 2x2 smd: 1(-2.2,0) 2(2.2,0)
SOT-23-3_L2.9-W1.3-P1.90-LS2.4-BR
  rect 1x0.65 smd: 1(1,-0.95) 2(1,0.95) 3(-1,0)
SOT-23-5_L3.0-W1.7-P0.95-LS2.8-BR
  rect 1.1x0.6 smd: 1(1.3,-0.95) 2(1.3,0) 3(1.3,0.95) 4(-1.3,0.95) 5(-1.3,-0.95)
SOT-23-6_L2.9-W1.6-P0.95-LS2.8-BL
  rect 0.532x1.072 smd: 1(-0.95,-1.149) 2(0,-1.149) 3(0.95,-1.149) 4(0.95,1.149) 5(0,1.149) 6(-0.95,1.149)
TSSOP-14_L5.0-W4.4-P0.65-LS6.4-BL
  rect 0.4x1.7 smd: 1(-1.95,-2.8) 2(-1.3,-2.8) 3(-0.65,-2.8) 4(0,-2.8) 5(0.65,-2.8) 6(1.3,-2.8) 7(1.95,-2.8) 8(1.95,2.8) 9(1.3,2.8) 10(0.65,2.8) 11(0,2.8) 12(-0.65,2.8) 13(-1.3,2.8) 14(-1.95,2.8)

## Nets
As in the schematic.

Pads without a net: H1 1 2 3 4 5 6 7; U1 5; U2 12; U3 1; U10 5 6; U11 2 3 4 6 12 13 15 16 17 18; U12 1 2 3 4 5 6 7 8 9 10 15 16 17 18

## Via types
v1: diameter 0.61, hole 0.305, Top Layer to Bottom Layer, 34 vias

## Routing (per net, layer and track width the routed paths; a pad name or vN(x,y) marks a point on that pad's centre or on a via; arc(x,y) is an arc through that point)
3V3: length 122.1
  Top Layer w0.33: U2.14 18.64,44.63 v1(18.64,46.4) ; J3.1 90.01,42.09 87.98,40.05 55.59,40.05 49.88,34.34 53.43,34.34 R11.1 53.7,34.34 R12.2 ; U3.5 58.55,38.72 C4.1 60.86,38.78 v1(62.33,38.78)
  Bottom Layer w0.33: v1(62.33,38.78) 51.91,38.78 49.63,36.5 U11.1 35.66,48.31 20.54,48.31 v1(18.64,46.4)
+5V: length 78.6
  Top Layer w0.406: 42.36,43.82 C7.1 C8.1 46,43.23 50.71,43.23 L1.2 ; 42.36,43.82 39.52,46.66 R9.2 ; 42.36,43.82 35.82,43.82 34.77,44.88 R8.2 32.47,51.24 J2.1 27.4,56.31 15.72,56.31 11.02,51.61 6.83,51.61 5.43,50.21 5.43,37.01 3.91,35.48 U11.19
+12V: length 67.1
  Top Layer w0.508: U1.3 39.47,55.17 40.93,56.63 C1.1 42.01,56.63 C6.1 50.2,56.63 C9.1 ; C9.1 52.54,58.98 73.38,58.98 77.19,55.17 77.19,45.35 76.59,44.75 ; C9.1 53.06,55.67 61.44,55.67 J1_12V_IN.1
GND:
  vias: v1(11.02,58.47) v1(13.06,56.15) v1(16.1,45.01) v1(16.61,36.16) v1(16.61,32.31) v1(23.74,52.58) v1(26,54.79) v1(26,50.47) v1(28.24,52.58) v1(33.75,7.06) v1(34.97,7.06) v1(40.1,51.48) v1(40.35,48.82) v1(42.51,48.44) v1(43.01,53.9) v1(45.58,48.44) v1(46.58,53.39) v1(49.13,52.25) v1(49.63,7.16) v1(51.52,8.94) v1(52.8,52.25) v1(56.87,52.96) v1(59.02,50.72) v1(61.26,52.96) v1(64.36,42.59) v1(65.82,17.19) v1(66.39,42.59) v1(69.69,17.19) v1(87.68,45.64) v1(87.68,43.75)
BED_ENABLE: length 13.7
  Top Layer w0.254: U3.4 58.55,35.52 R12.1 67.15,34.34 U10.1
BED_VCC: length 16.5
  Top Layer w0.381: U10.2 U10.3 U10.4 68.93,27.35 70.33,25.96 70.33,20.5 69.56,19.73 U10.7
ENC_A: length 8.1
  Top Layer w0.254: U11.10 25.24,35.86 22.7,35.86 22.04,36.53 U2.2
ENC_A_RAW: length 23.2
  Top Layer w0.254: R5.1 7.84,38.15 6.83,39.17 6.83,46.91 8.1,48.18 CN1.3
ENC_B: length 9
  Top Layer w0.254: U11.9 27.15,36.5 24.1,36.5 23.34,37.26 U2.4
ENC_B_RAW: length 16
  Top Layer w0.254: CN1.4 9.37,44.68 8.48,43.79 8.48,39.93 9.11,39.29 14.45,39.29 15.34,40.18 R3.1
ENC_Z: length 10
  Top Layer w0.254: U2.6 24.64,37.64 25.13,37.15 29.04,37.15 U11.8
ENC_Z_RAW: length 6.5
  Top Layer w0.254: CN1.5 11.51,41.18 12.54,42.21 R4.1
FLOW: length 13.7
  Top Layer w0.254: v1(23.97,46.28) 23.99,46.26 U2.10
  Bottom Layer w0.254: U11.11 24.23,46.02 v1(23.97,46.28)
FLOW_MID: length 4.5
  Top Layer w0.254: U2.11 23.34,43.61 23.84,43.1 24.86,43.1 25.29,43.53 U2.8
FLOW_RAW: length 15.3
  Top Layer w0.254: J2.3 25.24,48.31 28.16,48.31 29.94,46.53 29.94,44.9 29.92,44.88 ; 29.92,44.88 R8.1 ; 29.92,44.88 R2.2
FORCE: length 59.6
  Top Layer w0.254: 85.95,53.01 84.93,51.99 84.93,42.84 82.91,40.82 55.34,40.82 50.51,35.99 41.12,35.99 U11.5
MOTOR_DIR: length 37.3
  Top Layer w0.254: U12.12 35.02,12.11 U10.10
MOTOR_EN_CTRL: length 39.1
  Top Layer w0.254: U3.2 54.61,37.77 v1(54.2,37.35) 54.2,36.62 R11.2
  Bottom Layer w0.254: U12.14 36.93,10.97 54.2,28.24 v1(54.2,37.35)
MOTOR_STEP: length 40.8
  Top Layer w0.254: U10.9 35.02,14.65 U12.11
VALVE_CTRL: length 32.4
  Top Layer w0.254: R1.1 62.07,42.73 60.92,41.58 54.96,41.58 50.13,36.75 36.8,36.75 U11.7
VALVE_NEG: length 11.6
  Top Layer w0.254: Q1.3 D1.2
  Top Layer w0.508: 72.1,45.35 72.1,52.63 72.49,53.01
$1N2491: length 5.7
  Top Layer w0.254: U1.6 39.34,50.4 42.01,50.4
$1N2497: length 13.9
  Top Layer w0.406: U1.2 40.29,53.52 C5.2 42.96,51.8 ; L1.1 48.67,50.98 43.78,50.98 42.96,51.8
$1N2551: length 10.6
  Top Layer w0.254: R9.1 R10.1 36.54,48.82 35.66,49.71 35.66,54.02 36.1,54.47 U1.4
$1N3307: length 3.1
  Top Layer w0.254: U2.1 20.5,38.15 R5.2
$1N3560: length 6.2
  Top Layer w0.254: R3.2 19.52,41.07 22.19,41.07 22.7,40.56 22.7,39.05 U2.3
$1N3669: length 5.2
  Top Layer w0.254: U2.9 24.64,45.8 25.11,46.28 26.77,46.28 27.41,45.63 R2.1
$1N3677: length 8.2
  Top Layer w0.254: U2.5 23.99,41.56 23.34,42.21 R4.2
$1N3934: length 4.4
  Top Layer w0.254: R1.2 R6.2 66.21,45.51 Q1.1

## Copper pours and planes (outline as drawn; the poured copper is in the pictures)
GND on Top Layer: -0.41,65.58 104.11,65.58 104.11,-2.62 -0.41,-2.62
GND on Bottom Layer: -3.33,66.22 100.55,66.22 100.55,-1.86 -3.33,-1.86

## Text on the board
Top Silkscreen Layer: GND | 12V IN | Valve | 12V | Force | 3V3 | 5V | A | B | Z | Motor | Flow
